# Altium schematic sheet [13] - TOP BOARD HEADER.SchDoc
size A4; DocumentNumber: 13; SheetNumber: 13; SheetTotal: 14
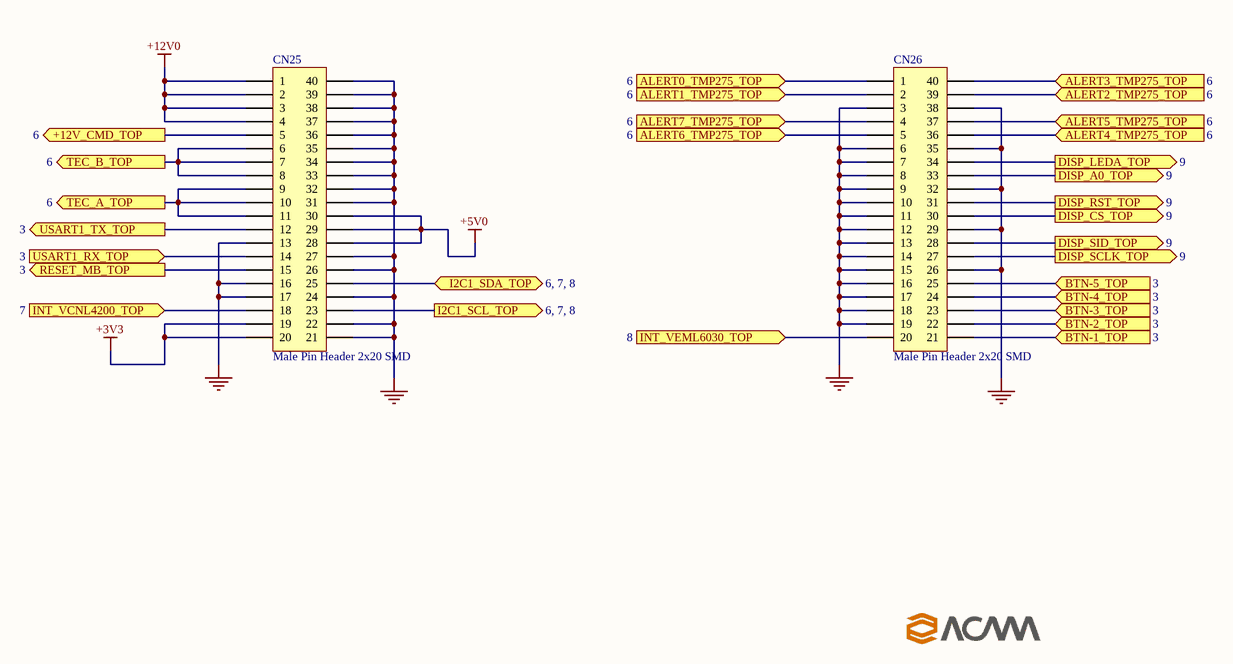
[diagram p0: [13] - TOP BOARD HEADER.SchDoc]

## Parts
CN25  Male Pin Header 2x20 SMD  [HEADER_2x20_SMD]
CN26  Male Pin Header 2x20 SMD  [HEADER_2x20_SMD]

## Ports
+12V_CMD_TOP (out, see 6), ALERT0_TMP275_TOP (in, see 6), ALERT1_TMP275_TOP (in, see 6), ALERT2_TMP275_TOP (in, see 6), ALERT3_TMP275_TOP (in, see 6), ALERT4_TMP275_TOP (in, see 6), ALERT5_TMP275_TOP (in, see 6), ALERT6_TMP275_TOP (in, see 6), ALERT7_TMP275_TOP (in, see 6), BTN-1_TOP (in, see 3), BTN-2_TOP (in, see 3), BTN-3_TOP (in, see 3), BTN-4_TOP (in, see 3), BTN-5_TOP (in, see 3), DISP_A0_TOP (out, see 9), DISP_CS_TOP (out, see 9), DISP_LEDA_TOP (out, see 9), DISP_RST_TOP (out, see 9), DISP_SCLK_TOP (out, see 9), DISP_SID_TOP (out, see 9), I2C1_SCL_TOP (out, see 6, 7, 8), I2C1_SDA_TOP (bidir, see 6, 7, 8), INT_VCNL4200_TOP (in, see 7), INT_VEML6030_TOP (in, see 8), RESET_MB_TOP (out, see 3), TEC_A_TOP (out, see 6), TEC_B_TOP (out, see 6), USART1_RX_TOP (in, see 3), USART1_TX_TOP (out, see 3)

## Nets
+3V3: CN25.19 CN25.20
+5V0: CN25.28 CN25.29 CN25.30
+12V0: CN25.1 CN25.2 CN25.3 CN25.4
GND: CN25.13 CN25.16 CN25.17 CN25.21 CN25.22 CN25.24 CN25.26 CN25.27 CN25.31 CN25.32 CN25.33 CN25.34 CN25.35 CN25.36 CN25.37 CN25.38 CN25.39 CN25.40 CN26.3 CN26.6 CN26.7 CN26.8 CN26.9 CN26.10 CN26.11 CN26.12 CN26.13 CN26.14 CN26.15 CN26.16 CN26.17 CN26.18 CN26.19 CN26.26 CN26.29 CN26.32 CN26.35 CN26.38
+12V_CMD_TOP: CN25.5 ; port +12V_CMD_TOP
ALERT0_TMP275_TOP: CN26.1 ; port ALERT0_TMP275_TOP
ALERT1_TMP275_TOP: CN26.2 ; port ALERT1_TMP275_TOP
ALERT2_TMP275_TOP: CN26.39 ; port ALERT2_TMP275_TOP
ALERT3_TMP275_TOP: CN26.40 ; port ALERT3_TMP275_TOP
ALERT4_TMP275_TOP: CN26.36 ; port ALERT4_TMP275_TOP
ALERT5_TMP275_TOP: CN26.37 ; port ALERT5_TMP275_TOP
ALERT6_TMP275_TOP: CN26.5 ; port ALERT6_TMP275_TOP
ALERT7_TMP275_TOP: CN26.4 ; port ALERT7_TMP275_TOP
BTN-1_TOP: CN26.21 ; port BTN-1_TOP
BTN-2_TOP: CN26.22 ; port BTN-2_TOP
BTN-3_TOP: CN26.23 ; port BTN-3_TOP
BTN-4_TOP: CN26.24 ; port BTN-4_TOP
BTN-5_TOP: CN26.25 ; port BTN-5_TOP
DISP_A0_TOP: CN26.33 ; port DISP_A0_TOP
DISP_CS_TOP: CN26.30 ; port DISP_CS_TOP
DISP_LEDA_TOP: CN26.34 ; port DISP_LEDA_TOP
DISP_RST_TOP: CN26.31 ; port DISP_RST_TOP
DISP_SCLK_TOP: CN26.27 ; port DISP_SCLK_TOP
DISP_SID_TOP: CN26.28 ; port DISP_SID_TOP
I2C1_SCL_TOP: CN25.23 ; port I2C1_SCL_TOP
I2C1_SDA_TOP: CN25.25 ; port I2C1_SDA_TOP
INT_VCNL4200_TOP: CN25.18 ; port INT_VCNL4200_TOP
INT_VEML6030_TOP: CN26.20 ; port INT_VEML6030_TOP
RESET_MB_TOP: CN25.15 ; port RESET_MB_TOP
TEC_A_TOP: CN25.9 CN25.10 CN25.11 ; port TEC_A_TOP
TEC_B_TOP: CN25.6 CN25.7 CN25.8 ; port TEC_B_TOP
USART1_RX_TOP: CN25.14 ; port USART1_RX_TOP
USART1_TX_TOP: CN25.12 ; port USART1_TX_TOP

## Library data of the parts
CN25 CN26 = Pin header Male 2x20 smd: SMD Male Pin Header 2.54mm Pitch, 2x20; System: Connector; Value: Male Pin Header 2x20 SMD